# EAGLE design shared_pcb (EAGLE 7.5.0)
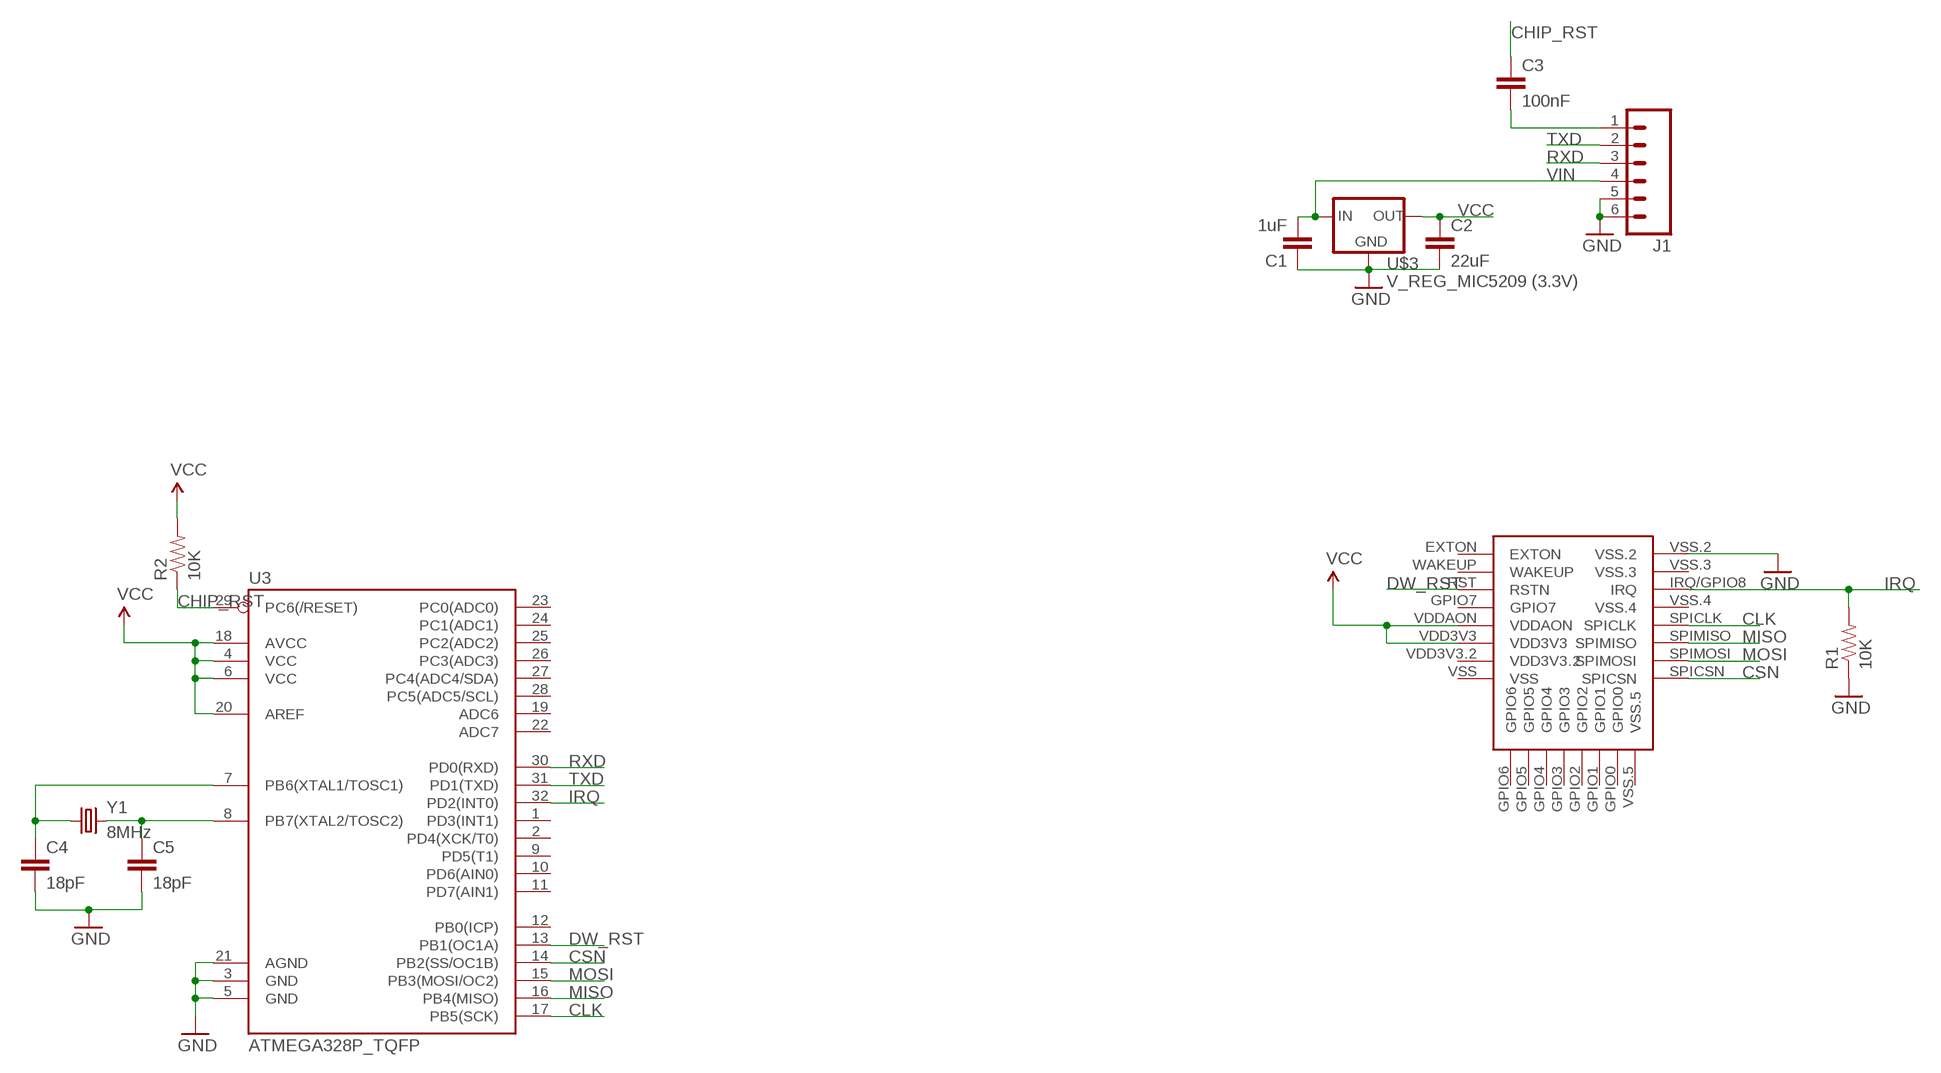
[diagram p0: schematic, sheet 1]

## Parts
C1  1uF  CAP1206  [1206]
C2  22uF  CAP1206  [1206]
C3  100nF  CAP1206  [1206]
C4  18pF  CAP1206  [1206]
C5  18pF  CAP1206  [1206]
J1  M06LOCK  [1X06_LOCK]
R1  10K  RESISTOR1206  [1206]
R2  10K  RESISTOR1206  [1206]
U3  ATMEGA328P_TQFP  [TQFP32-08]
U$1  DWM1000  [DWM1000]
U$3  V_REG_MIC5209 (3.3V)  V_REG_MIC2920  [SOT223]
Y1  8MHz  CRYSTALTXC-7A  [CRYSTAL-TXC-7A]

## Nets
CHIP_RST: C3.1 R2.1 U3.29(PC6(/RESET))
CLK: U3.17(PB5(SCK)) U$1.SPICLK
CSN: U3.14(PB2(SS/OC1B)) U$1.SPICSN
DW_RST: U3.13(PB1(OC1A)) U$1.RST(RSTN)
GND: C1.1 C2.2 C4.2 C5.2 J1.5 J1.6 R1.1 U3.3(GND) U3.5(GND) U3.21(AGND) U$1.VSS.2 U$3.2(GND)
IRQ: R1.2 U3.32(PD2(INT0)) U$1.IRQ/GPIO8(IRQ)
MISO: U3.16(PB4(MISO)) U$1.SPIMISO
MOSI: U3.15(PB3(MOSI/OC2)) U$1.SPIMOSI
N$3: C3.2 J1.1
N$6: C4.1 U3.7(PB6(XTAL1/TOSC1)) Y1.P$1
N$7: C5.1 U3.8(PB7(XTAL2/TOSC2)) Y1.P$2
RXD: J1.3 U3.30(PD0(RXD))
TXD: J1.2 U3.31(PD1(TXD))
VCC: C2.1 R2.2 U3.4(VCC) U3.6(VCC) U3.18(AVCC) U3.20(AREF) U$1.VDD3V3 U$1.VDDAON U$3.3(OUT)
VIN: C1.2 J1.4 U$3.1(IN)
Unconnected: U3.1(PD3(INT1)) U3.2(PD4(XCK/T0)) U3.9(PD5(T1)) U3.10(PD6(AIN0)) U3.11(PD7(AIN1)) U3.12(PB0(ICP)) U3.19(ADC6) U3.22(ADC7) U3.23(PC0(ADC0)) U3.24(PC1(ADC1)) U3.25(PC2(ADC2)) U3.26(PC3(ADC3)) U3.27(PC4(ADC4/SDA)) U3.28(PC5(ADC5/SCL)) U$1.EXTON U$1.GPIO0 U$1.GPIO1 U$1.GPIO2 U$1.GPIO3 U$1.GPIO4 U$1.GPIO5 U$1.GPIO6 U$1.GPIO7 U$1.VDD3V3.2 U$1.VSS U$1.VSS.3 U$1.VSS.4 U$1.VSS.5 U$1.WAKEUP

## Library data of the parts
C1-C5 = SparkFun-Capacitors:CAP: Capacitor Standard 0603 ceramic capacitor, and 0.1" leaded capacitor.
J1 = SparkFun-Connectors:M06: Header 6 Standard 6-pin 0.1" header. Use with straight break away headers (SKU : PRT-00116), right angle break away headers (PRT-00553), swiss pins (PRT-00743), machine pins (PRT-00117), and female headers (PRT-00115). Molex polarized connector foot print use with SKU : PRT-08094 with associated crimp pins and housings. NOTES ON THE VARIANTS LOCK and LOCK_LONGPADS... This footprint was designed to help hold the alignment of a through-hole component (i.e. 6-pin header) while soldering it into place. You may notice that each hole has been shifted either up or down by 0.005 of an inch from it's more standard position (which is a perfectly straight line). This slight alteration caused the pins (the squares in the middle) to touch the edges of the holes. Because they are alternating, it causes a "brace" to hold the component in place. 0.005 has proven to be the perfect amount of "off-center" position when using our standard breakaway headers. Although looks a little odd when you look at the bare footprint, once you have a header in there, the alteration is very hard to notice. Also,if you push a header all the way into place, it is covered up entirely on the bottom side. This idea of altering the position of holes to aid alignment will be further integrated into the Sparkfun Library for other footprints. It can help hold any component with 3 or more connection pins.
R1 R2 = SparkFun-Passives:RESISTOR: Resistor Basic schematic elements and footprints for 0603, 1206, and PTH resistors.
U3 = SparkFun-DigitalIC:ATMEGA328P_TQFP; PROD_ID: IC-09069
U$1 = DWM1000:DWM1000
U$3 = SparkFun-PowerIC:V_REG_MIC2920: MIC2920A (http://www.micrel.com/_PDF/mic2920.pdf) - 400mA output LDO Regulator
Y1 = SparkFun-FreqCtrl:CRYSTAL: Various standard crystals. Proven footprints.

## Board
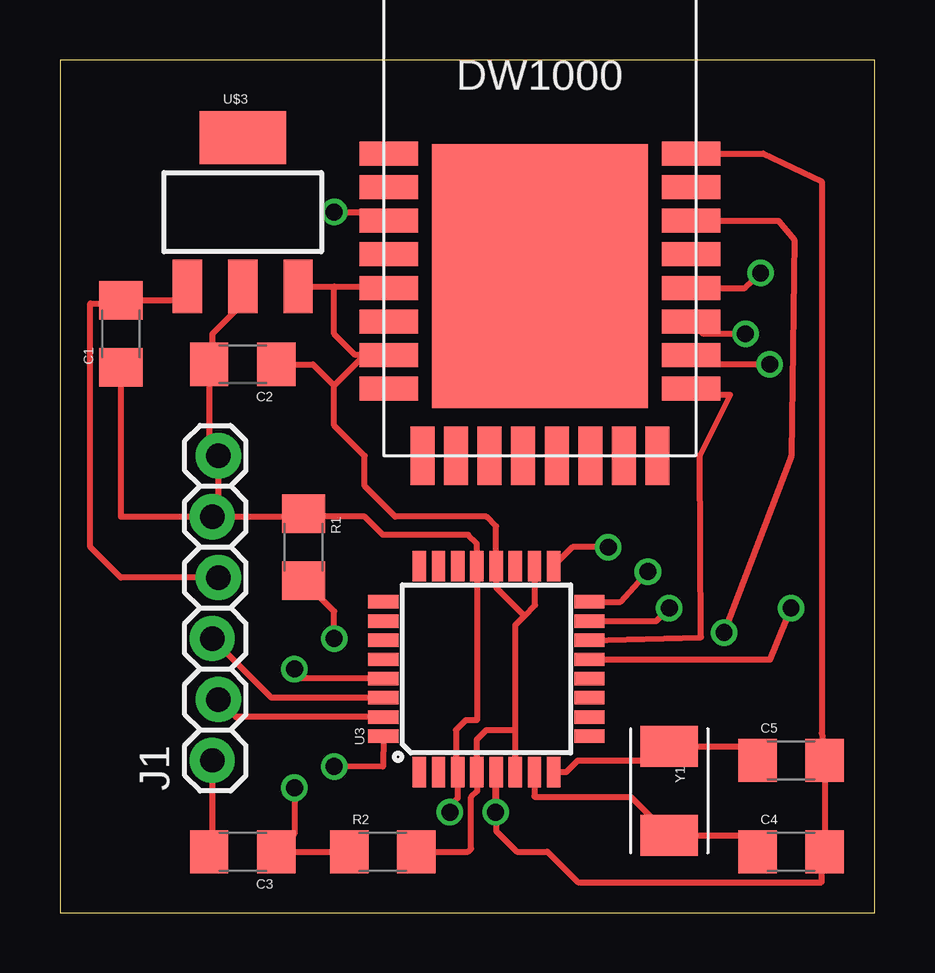
[diagram p1: board, top side]
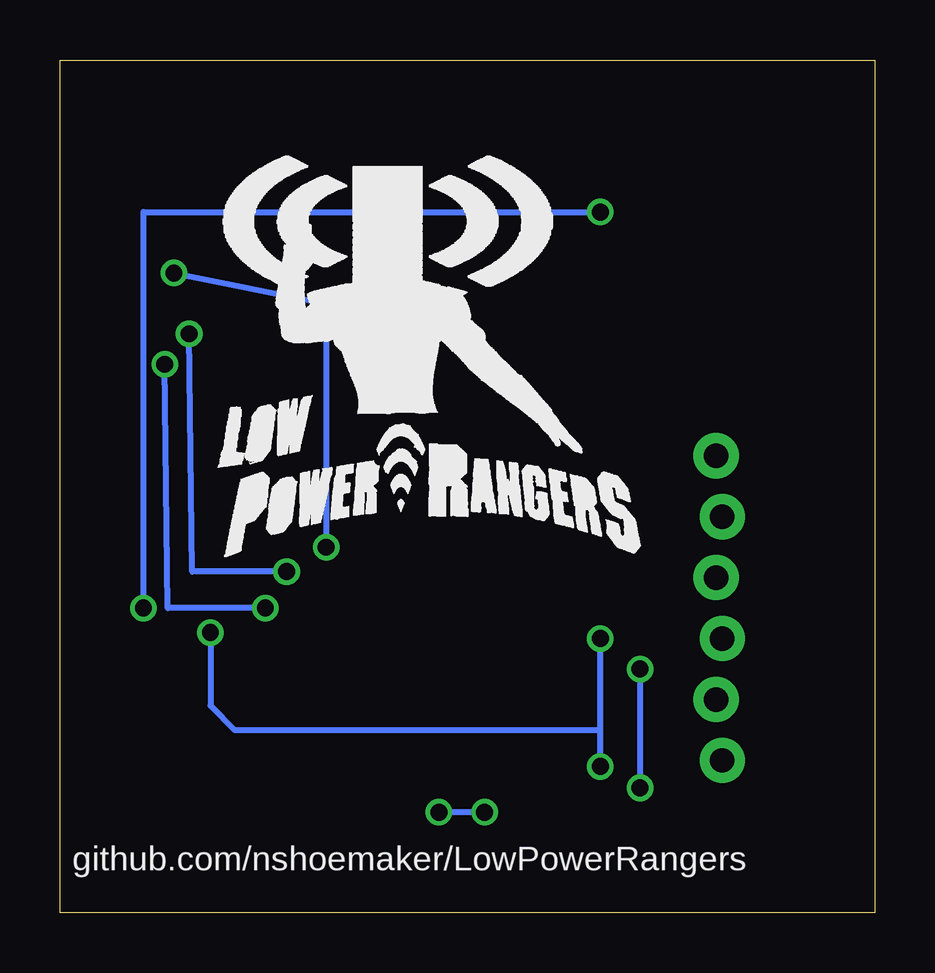
[diagram p2: board, bottom side, seen from below]

Size 33.96 x 35.55 mm. Coordinates in mm from the lower left corner, seen from the top.
Outline: 0,0 33.96,0 33.96,35.55 0,35.55 0,0
Copper layers (1*16): Top 0.035mm / dielectric 1.5mm / Bottom 0.035mm
Design rules "default": minimum track width 10mil, minimum drill 24mil, track to track 8mil, track to pad 8mil, pad to pad 8mil, via to via 8mil, smd to smd 8mil, copper to edge 40mil, drill to drill 8mil, minimum pad ring 10mil, minimum via ring 8mil, stop-mask expansion 4mil, vias tented up to drill 0mil, thermal gap 10mil

### Footprints (pad centres in the part's own frame; a part is rotated, then mirrored left to right if it is on the bottom)
1206 = smd 1.6 x 1.8: 1 -1.4,0; 2 1.4,0
1X06_LOCK = drill 1.016 pad 1.88: 1 0,0; 2 2.54,-0.254; 3 5.08,0; 4 7.62,-0.254; 5 10.16,0; 6 12.7,-0.254
TQFP32-08 = smd 1.27 x 0.559: 1 -4.293,2.8; 2 -4.293,2; 3 -4.293,1.2; 4 -4.293,0.4; 5 -4.293,-0.4; 6 -4.293,-1.2; 7 -4.293,-2; 8 -4.293,-2.8; 17 4.293,-2.8; 18 4.293,-2; 19 4.293,-1.2; 20 4.293,-0.4; 21 4.293,0.4; 22 4.293,1.2; 23 4.293,2; 24 4.293,2.8 | smd 0.559 x 1.27: 9 -2.8,-4.293; 10 -2,-4.293; 11 -1.2,-4.293; 12 -0.4,-4.293; 13 0.4,-4.293; 14 1.2,-4.293; 15 2,-4.293; 16 2.8,-4.293; 25 2.8,4.293; 26 2,4.293; 27 1.2,4.293; 28 0.4,4.293; 29 -0.4,4.293; 30 -1.2,4.293; 31 -2,4.293; 32 -2.8,4.293
DWM1000 = smd 2.45 x 1: EXTON -2.8,12.6; GPIO7 -2.8,8.4; IRQ/GPIO8 9.8,9.8; RST -2.8,9.8; SPICLK 9.8,7; SPICSN 9.8,2.8; SPIMISO 9.8,5.6; SPIMOSI 9.8,4.2; VDD3V3 -2.8,4.2; VDD3V3.2 -2.8,5.6; VDDAON -2.8,7; VSS -2.8,2.8; VSS.2 9.8,12.6; VSS.3 9.8,11.2; VSS.4 9.8,8.4; WAKEUP -2.8,11.2 | smd 9 x 11: GND 3.5,7.5 | smd 1 x 2.45: GPIO0 7,0; GPIO1 5.6,0; GPIO2 4.2,0; GPIO3 2.8,0; GPIO4 1.4,0; GPIO5 0,0; GPIO6 -1.4,0; VSS.5 8.4,0
SOT223 = smd 1.219 x 2.235: 1 -2.311,-3.099; 2 0,-3.099; 3 2.311,-3.099 | smd 3.6 x 2.2: 4 0,3.099
CRYSTAL-TXC-7A = smd 1.7 x 2.4: P$1 1.85,0; P$2 -1.85,0

### Placement (x,y rotation side)
C1  2.54,24.13 90 top
C2  7.62,22.86 180 top
C3  7.62,2.54 180 top
C4  30.48,2.54 0 top
C5  30.48,6.35 0 top
J1  6.35,6.35 90 top
R1  10.16,15.24 270 top
R2  13.46,2.54 0 top
U3  17.78,10.16 90 top
U$1  16.51,19.05 0 top
U$3  7.62,29.21 0 top
Y1  25.4,5.08 270 top

### Tracks (layer width: path | path; a pad name or v marks a point on that pad's centre or on a via)
CHIP_RST  (via drill 0.7)
  Top 0.254: R2.1 C3.1 9.78,3.3 v9.78,5.21 | U3.29 9.8,9.76 v9.78,10.16
  Bottom 0.254: v9.78,10.16 v9.78,5.21
CLK  (via drill 0.7)
  Top 0.254: U$1.SPICLK 28.56,26.05 v29.21,26.67 | v22.86,15.24 21.37,15.24 U3.17
  Bottom 0.254: v29.21,26.67 22.86,25.4 v22.86,15.24
CSN
  Top 0.254: U3.14 26.73,11.49 26.67,19.05 27.94,21.59 26.57,21.59 U$1.SPICSN
DW_RST  (via drill 0.7)
  Top 0.254: U3.13 29.61,10.56 v30.48,12.7 | v11.43,29.21 13.35,29.21 U$1.RST
  Bottom 0.254: v30.48,12.7 30.48,29.21 v11.43,29.21
GND  (via drill 0.7)
  Top 0.254: J1.5 6.6,16.76 J1.6 6.22,19.43 C2.2 6.35,22.99 6.35,24.13 7.62,25.4 U$3.2 | J1.5 10.03,16.51 R1.1 10.29,16.51 12.7,16.51 13.46,15.75 17.02,15.75 17.38,15.39 U3.21 17.38,8.02 16.91,8.02 16.51,7.62 16.51,5.94 U3.3 16.58,4.77 16.26,4.45 v16.26,4.19 | 26.67,31.75 26.57,31.65 U$1.VSS.2 29.31,31.65 31.75,30.48 31.75,7.49 C5.2 31.88,2.67 31.75,2.54 C4.2 31.75,2.41 31.75,1.27 21.59,1.27 20.32,2.54 19.05,2.54 18.18,3.41 U3.5 18.16,5.85 v18.16,4.19 | C1.1 2.54,16.51 J1.5
  Bottom 0.254: v16.26,4.19 v18.16,4.19
IRQ  (via drill 0.7)
  Top 0.254: U3.32 13.47,6.09 v11.43,6.1 | v11.43,11.43 11.43,12.57 R1.2 | U$1.IRQ/GPIO8 29.95,28.85 30.61,28.07 30.48,19.05 v27.69,11.68
  Bottom 0.254: v11.43,6.1 11.43,7.62 | 11.43,7.62 v11.43,11.43 | v27.69,11.68 27.69,8.64 26.67,7.62 11.43,7.62
MISO  (via drill 0.7)
  Top 0.254: U3.16 23.37,12.96 v24.51,14.22 | v28.57,24.13 26.83,24.13 U$1.SPIMISO
  Bottom 0.254: v24.51,14.22 28.45,14.22 v28.57,24.13
MOSI  (via drill 0.7)
  Top 0.254: U3.15 24.86,12.16 v25.4,12.7 | v29.59,22.86 26.7,22.86 U$1.SPIMOSI
  Bottom 0.254: v25.4,12.7 29.46,12.7 v29.59,22.86
N$3
  Top 0.254: J1.1 6.35,2.67 C3.2
N$6
  Top 0.254: 24.82,3.81 Y1.P$1 | Y1.P$1 28.39,3.23 C4.1 | U3.7 19.78,4.86 19.81,4.83 23.8,4.83 Y1.P$1
N$7
  Top 0.254: U3.8 21.11,5.87 21.59,6.35 24.82,6.35 Y1.P$2 28.5,6.93 C5.1
RXD
  Top 0.254: U3.30 8.82,8.96 J1.3
TXD
  Top 0.254: U3.31 7.33,8.16 J1.2
VCC
  Top 0.254: 19.05,6.35 18.98,6.28 U3.6 18.98,7.62 | U$3.3 11.43,26.11 | 11.43,26.11 13.65,26.11 U$1.VDDAON | U$1.VDD3V3 12.7,23.25 | 12.7,23.25 12.31,23.25 11.43,24.13 11.43,26.11 | R2.2 17.02,2.54 17.14,2.67 17.14,4.83 17.4,5.08 17.4,5.85 U3.4 17.38,7.22 17.78,7.62 18.98,7.62 | 18.98,7.62 18.98,11.99 19.37,12.38 | 19.37,12.38 19.81,12.83 19.81,14.42 U3.18 | 19.37,12.38 18.18,13.57 U3.20 18.18,16.11 17.78,16.51 13.97,16.51 12.7,17.78 12.7,19.05 11.43,20.32 11.43,21.98 | 11.43,21.98 12.7,23.25 | C2.1 10.55,22.86 11.43,21.98
VIN
  Top 0.254: J1.4 2.54,13.97 1.27,15.24 1.27,25.4 2.41,25.4 C1.2 4.73,25.53 U$3.1

### Text on the board
bPlace: github.com/nshoemaker/LowPowerRangers